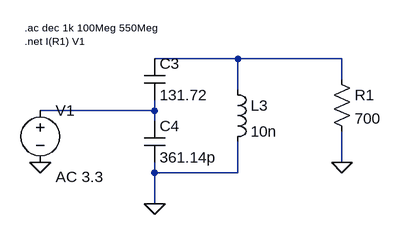
[diagram p0: schematic RF_Impedence_Matching.asc]
RF_Impedence_Matching.asc, the LTspice schematic file:
Version 4
SHEET 1 880 680
WIRE 192 192 64 192
WIRE 352 192 192 192
WIRE 352 224 352 192
WIRE 192 240 192 192
WIRE 64 272 64 256
WIRE 64 272 -112 272
WIRE 64 288 64 272
WIRE 192 368 192 320
WIRE 352 352 352 304
WIRE 64 368 64 352
WIRE 192 368 64 368
WIRE 64 416 64 368
FLAG -112 352 0
FLAG 352 352 0
FLAG 64 416 0
SYMBOL ind 176 224 R0
SYMATTR InstName L3
SYMATTR Value 10n
SYMATTR SpiceLine Ipk=800m Cpar=0 mfg="   ---" pn="   ---"
SYMBOL cap 48 192 R0
SYMATTR InstName C3
SYMATTR Value 131.72
SYMATTR SpiceLine Rser=0 Lser=0 mfg="   ---" pn="   ---" type="   ---"
SYMBOL voltage -112 256 R0
WINDOW 123 24 118 Left 2
SYMATTR Value2 AC 3.3
SYMATTR InstName V1
SYMATTR Value ""
SYMATTR SpiceLine Rser=50
SYMBOL res 336 208 R0
SYMATTR InstName R1
SYMATTR Value 700
SYMBOL cap 48 288 R0
SYMATTR InstName C4
SYMATTR Value 361.14p
SYMATTR SpiceLine Rser=0 Lser=0 mfg="   ---" pn="   ---" type="   ---"
TEXT -136 144 Left 1 !.ac dec 1k 100Meg 550Meg\n.net I(R1) V1

The netlist it stands for:
* RF_Impedence_Matching.asc
L3 N001 0 10n Ipk=800m Cpar=0 mfg="   ---" pn="   ---"
C3 N001 N002 131.72 Rser=0 Lser=0 mfg="   ---" pn="   ---" type="   ---"
V1 N002 0 AC 3.3 Rser=50
R1 N001 0 700
C4 N002 0 361.14p Rser=0 Lser=0 mfg="   ---" pn="   ---" type="   ---"
.ac dec 1k 100Meg 550Meg
.net I(R1) V1
.backanno
.end